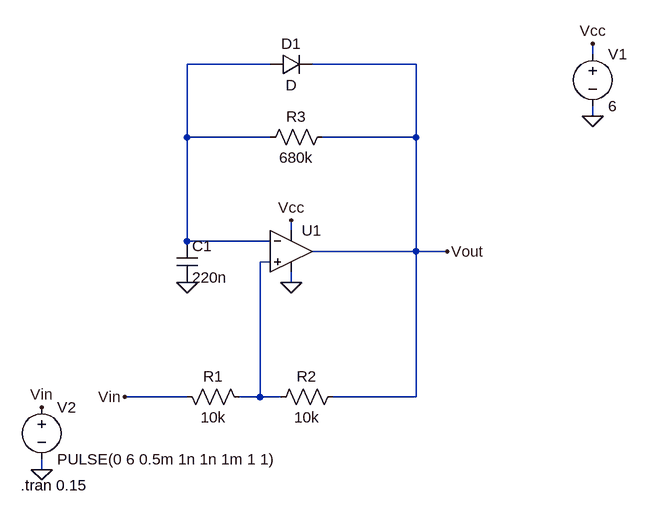
[diagram p0: schematic pulse_generator.asc]
pulse_generator.asc, the LTspice schematic file:
Version 4
SHEET 1 880 680
WIRE 768 -128 768 -144
WIRE 272 -112 144 -112
WIRE 496 -112 336 -112
WIRE 768 -32 768 -48
WIRE 144 0 144 -112
WIRE 272 0 144 0
WIRE 496 0 496 -112
WIRE 496 0 352 0
WIRE 304 144 304 128
WIRE 144 160 144 0
WIRE 272 160 144 160
WIRE 496 176 496 0
WIRE 496 176 336 176
WIRE 544 176 496 176
WIRE 272 192 256 192
WIRE 304 224 304 208
WIRE 144 400 48 400
WIRE 256 400 256 192
WIRE 256 400 224 400
WIRE 288 400 256 400
WIRE 496 400 496 176
WIRE 496 400 368 400
WIRE -80 512 -80 496
FLAG 304 224 0
FLAG 768 -32 0
FLAG 768 -144 Vcc
FLAG 304 128 Vcc
FLAG 48 400 Vin
FLAG 544 176 Vout
FLAG -80 512 0
FLAG 144 224 0
FLAG -80 416 Vin
SYMBOL res 240 416 M270
WINDOW 0 32 56 VTop 2
WINDOW 3 0 56 VBottom 2
SYMATTR InstName R1
SYMATTR Value 10k
SYMBOL res 384 384 R90
WINDOW 0 0 56 VBottom 2
WINDOW 3 32 56 VTop 2
SYMATTR InstName R2
SYMATTR Value 10k
SYMBOL res 368 -16 R90
WINDOW 0 0 56 VBottom 2
WINDOW 3 32 56 VTop 2
SYMATTR InstName R3
SYMATTR Value 680k
SYMBOL cap 128 160 R0
SYMATTR InstName C1
SYMATTR Value 220n
SYMBOL voltage 768 -144 R0
WINDOW 123 0 0 Left 2
WINDOW 39 0 0 Left 2
SYMATTR InstName V1
SYMATTR Value 6
SYMBOL diode 272 -96 R270
WINDOW 0 32 32 VTop 2
WINDOW 3 0 32 VBottom 2
SYMATTR InstName D1
SYMBOL voltage -80 400 R0
WINDOW 123 0 0 Left 2
WINDOW 39 0 0 Left 2
SYMATTR InstName V2
SYMATTR Value PULSE(0 6 0.5m 1n 1n 1m 1 1)
SYMBOL Opamps\\UniversalOpamp2 304 176 R0
SYMATTR InstName U1
SYMATTR SpiceLine ilimit=25m rail=20m Vos=0 phimargin=45
TEXT -112 536 Left 2 !.tran 0.15

The netlist it stands for:
* pulse_generator.asc
R1 N002 Vin 10k
R2 Vout N002 10k
R3 Vout N001 680k
C1 N001 0 220n
V1 Vcc 0 6
D1 N001 Vout D
V2 Vin 0 PULSE(0 6 0.5m 1n 1n 1m 1 1)
XU1 N002 N001 Vcc 0 Vout level.2 Avol=1Meg GBW=10Meg Slew=10Meg ilimit=25m rail=20m Vos=0 phimargin=45 en=0 enk=0 in=0 ink=0 Rin=500Meg  ; pins IN+ IN- V+ V- OUT
.model D D
.lib standard.dio
.tran 0.15
.lib UniversalOpamps2.sub
.backanno
.end